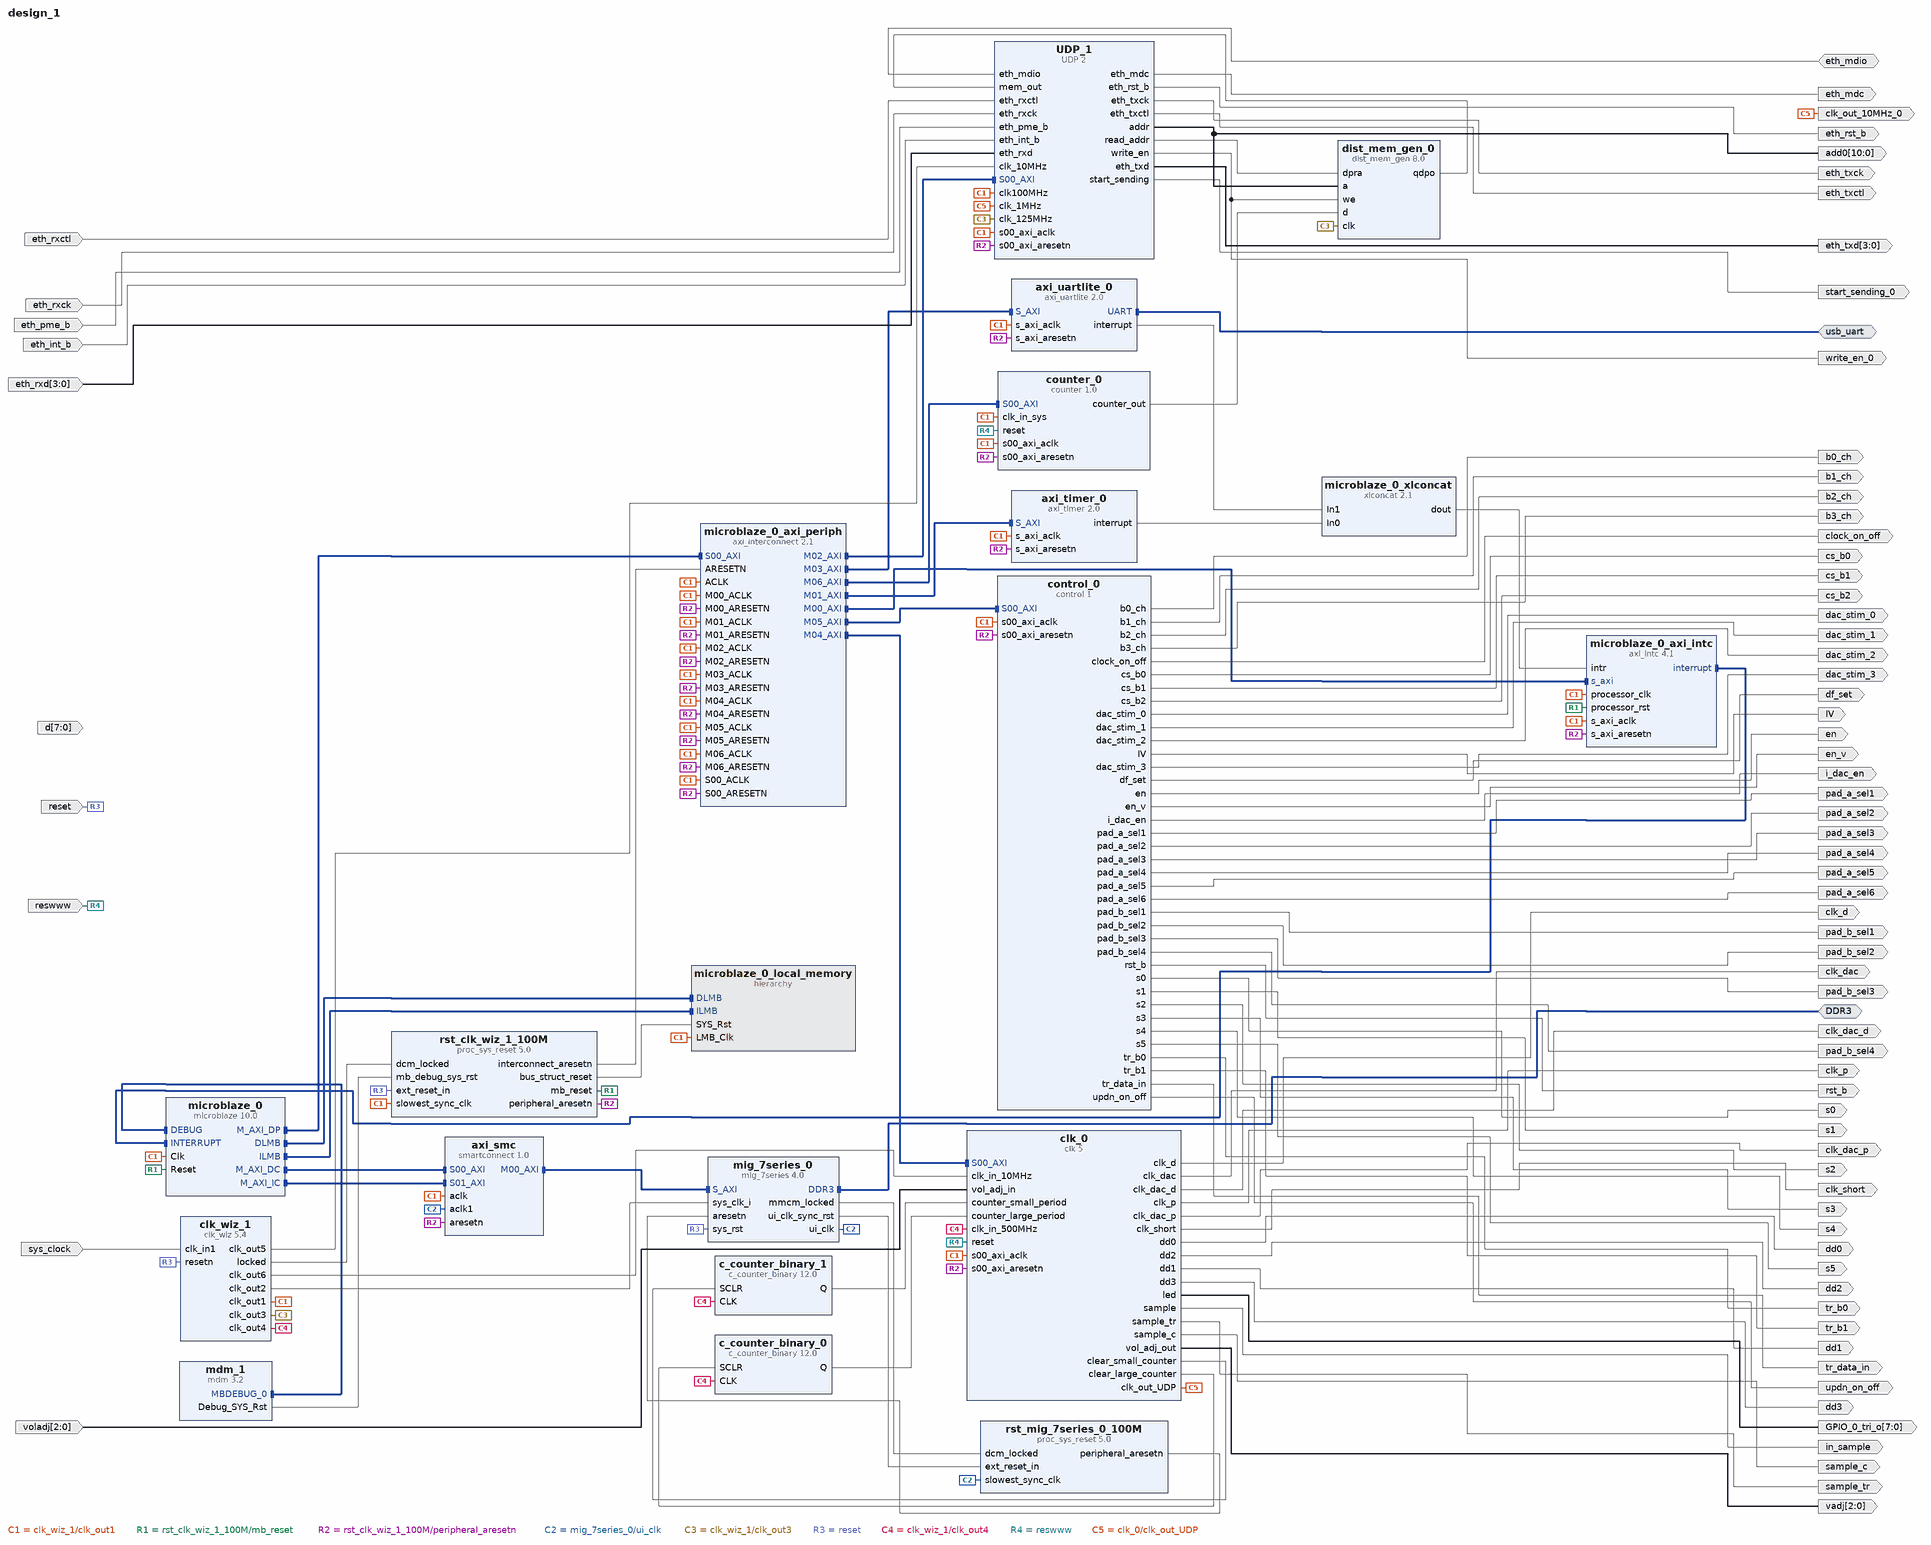
[diagram p0: block diagram of the top level]
# Vivado block design design_1, xc7a200tsbg484-1, Vivado 2017.4
create_bd_design design_1

create_bd_intf_port -mode Master -vlnv xilinx.com:interface:uart_rtl:1.0 usb_uart
create_bd_intf_port -mode Master -vlnv xilinx.com:interface:ddrx_rtl:1.0 DDR3
create_bd_port -dir I -from 7 -to 0 d
create_bd_port -dir I -type rst reset
set_property -dict {CONFIG.POLARITY ACTIVE_LOW} [get_bd_ports reset]
create_bd_port -dir I -type clk sys_clock
set_property -dict {CONFIG.FREQ_HZ 100000000 CONFIG.PHASE 0.000} [get_bd_ports sys_clock]
create_bd_port -dir O eth_rst_b
create_bd_port -dir O eth_mdc
create_bd_port -dir IO eth_mdio
create_bd_port -dir O eth_txck
create_bd_port -dir O eth_txctl
create_bd_port -dir O -from 3 -to 0 eth_txd
create_bd_port -dir I eth_rxctl
create_bd_port -dir I eth_rxck
create_bd_port -dir I eth_pme_b
create_bd_port -dir I eth_int_b
create_bd_port -dir I -from 3 -to 0 eth_rxd
create_bd_port -dir O -from 10 -to 0 add0
create_bd_port -dir O IV
create_bd_port -dir O b0_ch
create_bd_port -dir O b1_ch
create_bd_port -dir O b2_ch
create_bd_port -dir O b3_ch
create_bd_port -dir O -type clk clock_on_off
create_bd_port -dir O cs_b0
create_bd_port -dir O cs_b1
create_bd_port -dir O cs_b2
create_bd_port -dir O dac_stim_0
create_bd_port -dir O dac_stim_1
create_bd_port -dir O dac_stim_2
create_bd_port -dir O dac_stim_3
create_bd_port -dir O df_set
create_bd_port -dir O en
create_bd_port -dir O en_v
create_bd_port -dir O i_dac_en
create_bd_port -dir O pad_a_sel1
create_bd_port -dir O pad_a_sel2
create_bd_port -dir O pad_a_sel3
create_bd_port -dir O pad_a_sel4
create_bd_port -dir O pad_a_sel5
create_bd_port -dir O pad_a_sel6
create_bd_port -dir O pad_b_sel1
create_bd_port -dir O pad_b_sel2
create_bd_port -dir O pad_b_sel3
create_bd_port -dir O pad_b_sel4
create_bd_port -dir O rst_b
create_bd_port -dir O s0
create_bd_port -dir O s1
create_bd_port -dir O s2
create_bd_port -dir O s3
create_bd_port -dir O s4
create_bd_port -dir O s5
create_bd_port -dir O tr_b0
create_bd_port -dir O tr_b1
create_bd_port -dir O tr_data_in
create_bd_port -dir O updn_on_off
create_bd_port -dir O -from 7 -to 0 GPIO_0_tri_o
create_bd_port -dir O -type clk clk_p
create_bd_port -dir O clk_short
create_bd_port -dir O clk_d
create_bd_port -dir O clk_dac
create_bd_port -dir O clk_dac_p
create_bd_port -dir O clk_dac_d
create_bd_port -dir O dd2
create_bd_port -dir O dd3
create_bd_port -dir O dd1
create_bd_port -dir O dd0
create_bd_port -dir I -type rst reswww
set_property -dict {CONFIG.POLARITY ACTIVE_LOW} [get_bd_ports reswww]
create_bd_port -dir I -from 2 -to 0 voladj
create_bd_port -dir O in_sample
create_bd_port -dir O sample_tr
create_bd_port -dir O -from 2 -to 0 vadj
create_bd_port -dir O sample_c
create_bd_port -dir O clk_out_10MHz_0
create_bd_port -dir O write_en_0
create_bd_port -dir O start_sending_0

create_bd_cell -type hier microblaze_0_local_memory
create_bd_cell -type ip -vlnv xilinx.com:ip:xlconcat:2.1 microblaze_0_xlconcat
set_property -dict {CONFIG.NUM_PORTS 2} [get_bd_cells microblaze_0_xlconcat]
create_bd_cell -type ip -vlnv xilinx.com:ip:smartconnect:1.0 axi_smc
set_property -dict {CONFIG.NUM_SI 2 CONFIG.NUM_CLKS 2} [get_bd_cells axi_smc]
create_bd_cell -type ip -vlnv xilinx.com:ip:axi_timer:2.0 axi_timer_0
create_bd_cell -type ip -vlnv xilinx.com:ip:axi_uartlite:2.0 axi_uartlite_0
set_property -dict {CONFIG.USE_BOARD_FLOW true CONFIG.UARTLITE_BOARD_INTERFACE usb_uart} [get_bd_cells axi_uartlite_0]
create_bd_cell -type ip -vlnv xilinx.com:ip:clk_wiz:5.4 clk_wiz_1
set_property -dict [list \
  CONFIG.CLKOUT2_USED true \
  CONFIG.CLKOUT3_USED true \
  CONFIG.CLKOUT4_USED true \
  CONFIG.CLKOUT5_USED true \
  CONFIG.CLKOUT6_USED true \
  CONFIG.NUM_OUT_CLKS 6 \
  CONFIG.CLKOUT2_REQUESTED_OUT_FREQ 200.000 \
  CONFIG.CLKOUT3_REQUESTED_OUT_FREQ 125.000 \
  CONFIG.CLKOUT4_REQUESTED_OUT_FREQ 500.000 \
  CONFIG.CLKOUT5_REQUESTED_OUT_FREQ 20.000 \
  CONFIG.CLKOUT6_REQUESTED_OUT_FREQ 10 \
  CONFIG.PRIM_SOURCE Single_ended_clock_capable_pin \
  CONFIG.RESET_PORT resetn \
  CONFIG.MMCM_DIVCLK_DIVIDE 1 \
  CONFIG.MMCM_CLKOUT1_DIVIDE 5 \
  CONFIG.MMCM_CLKOUT2_DIVIDE 8 \
  CONFIG.MMCM_CLKOUT3_DIVIDE 2 \
  CONFIG.MMCM_CLKOUT4_DIVIDE 50 \
  CONFIG.MMCM_CLKOUT5_DIVIDE 100 \
  CONFIG.RESET_TYPE ACTIVE_LOW \
  CONFIG.USE_BOARD_FLOW true \
  CONFIG.CLK_IN1_BOARD_INTERFACE sys_clock \
  CONFIG.RESET_BOARD_INTERFACE reset \
  CONFIG.CLKOUT2_JITTER 114.829 \
  CONFIG.CLKOUT2_PHASE_ERROR 98.575 \
  CONFIG.CLKOUT3_JITTER 125.247 \
  CONFIG.CLKOUT3_PHASE_ERROR 98.575 \
  CONFIG.CLKOUT4_JITTER 97.082 \
  CONFIG.CLKOUT4_PHASE_ERROR 98.575 \
  CONFIG.CLKOUT5_JITTER 183.243 \
  CONFIG.CLKOUT5_PHASE_ERROR 98.575 \
  CONFIG.CLKOUT6_JITTER 209.588 \
  CONFIG.CLKOUT6_PHASE_ERROR 98.575 \
] [get_bd_cells clk_wiz_1]
create_bd_cell -type ip -vlnv xilinx.com:ip:mdm:3.2 mdm_1
create_bd_cell -type ip -vlnv xilinx.com:ip:microblaze:10.0 microblaze_0
set_property -dict [list \
  CONFIG.C_D_AXI 1 \
  CONFIG.C_D_LMB 1 \
  CONFIG.C_I_LMB 1 \
  CONFIG.C_DEBUG_ENABLED 1 \
  CONFIG.C_USE_ICACHE 1 \
  CONFIG.C_CACHE_BYTE_SIZE 32768 \
  CONFIG.C_USE_DCACHE 1 \
  CONFIG.C_DCACHE_BYTE_SIZE 32768 \
] [get_bd_cells microblaze_0]
create_bd_cell -type ip -vlnv xilinx.com:ip:axi_intc:4.1 microblaze_0_axi_intc
set_property -dict {CONFIG.C_HAS_FAST 1} [get_bd_cells microblaze_0_axi_intc]
create_bd_cell -type ip -vlnv xilinx.com:ip:axi_interconnect:2.1 microblaze_0_axi_periph
set_property -dict {CONFIG.NUM_MI 7 CONFIG.SYNCHRONIZATION_STAGES 2} [get_bd_cells microblaze_0_axi_periph]
create_bd_cell -type ip -vlnv xilinx.com:ip:mig_7series:4.0 mig_7series_0
set_property -dict {CONFIG.XML_INPUT_FILE board.prj CONFIG.RESET_BOARD_INTERFACE reset} [get_bd_cells mig_7series_0]
create_bd_cell -type ip -vlnv xilinx.com:ip:proc_sys_reset:5.0 rst_clk_wiz_1_100M
set_property -dict [list \
  CONFIG.C_EXT_RESET_HIGH 0 \
  CONFIG.USE_BOARD_FLOW true \
  CONFIG.RESET_BOARD_INTERFACE reset \
] [get_bd_cells rst_clk_wiz_1_100M]
create_bd_cell -type ip -vlnv xilinx.com:ip:proc_sys_reset:5.0 rst_mig_7series_0_100M
create_bd_cell -type ip -vlnv xilinx.com:ip:dist_mem_gen:8.0 dist_mem_gen_0
set_property -dict [list \
  CONFIG.depth 2048 \
  CONFIG.data_width 8 \
  CONFIG.memory_type dual_port_ram \
  CONFIG.input_options registered \
  CONFIG.input_clock_enable false \
  CONFIG.qualify_we_with_i_ce false \
  CONFIG.dual_port_address registered \
  CONFIG.simple_dual_port_address non_registered \
  CONFIG.output_options registered \
  CONFIG.Pipeline_Stages 1 \
  CONFIG.common_output_clk true \
  CONFIG.dual_port_output_clock_enable false \
] [get_bd_cells dist_mem_gen_0]
create_bd_cell -type ip -vlnv xilinx.com:user:control:1 control_0
create_bd_cell -type ip -vlnv xilinx.com:ip:c_counter_binary:12.0 c_counter_binary_0
set_property -dict {CONFIG.Implementation DSP48 CONFIG.Output_Width 32 CONFIG.SCLR true} [get_bd_cells c_counter_binary_0]
create_bd_cell -type ip -vlnv xilinx.com:ip:c_counter_binary:12.0 c_counter_binary_1
set_property -dict {CONFIG.Implementation DSP48 CONFIG.Output_Width 32 CONFIG.SCLR true} [get_bd_cells c_counter_binary_1]
create_bd_cell -type ip -vlnv xilinx.com:user:counter:1.0 counter_0
create_bd_cell -type ip -vlnv xilinx.com:user:UDP:2 UDP_1
create_bd_cell -type ip -vlnv xilinx.com:user:clk:5 clk_0

# ---- hierarchy /microblaze_0_local_memory ----
current_bd_instance /microblaze_0_local_memory
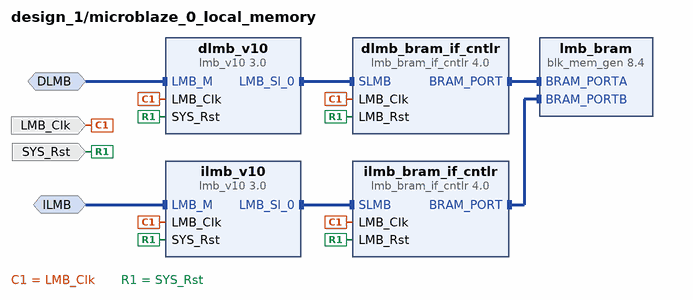
[diagram p1: block diagram inside /microblaze_0_local_memory]
create_bd_intf_pin -mode MirroredMaster -vlnv xilinx.com:interface:lmb_rtl:1.0 DLMB
create_bd_intf_pin -mode MirroredMaster -vlnv xilinx.com:interface:lmb_rtl:1.0 ILMB
create_bd_pin -dir I -type clk LMB_Clk
create_bd_pin -dir I -type rst SYS_Rst

create_bd_cell -type ip -vlnv xilinx.com:ip:lmb_v10:3.0 dlmb_v10
create_bd_cell -type ip -vlnv xilinx.com:ip:lmb_v10:3.0 ilmb_v10
create_bd_cell -type ip -vlnv xilinx.com:ip:lmb_bram_if_cntlr:4.0 dlmb_bram_if_cntlr
set_property -dict {CONFIG.C_ECC 0} [get_bd_cells dlmb_bram_if_cntlr]
create_bd_cell -type ip -vlnv xilinx.com:ip:lmb_bram_if_cntlr:4.0 ilmb_bram_if_cntlr
set_property -dict {CONFIG.C_ECC 0} [get_bd_cells ilmb_bram_if_cntlr]
create_bd_cell -type ip -vlnv xilinx.com:ip:blk_mem_gen:8.4 lmb_bram
set_property -dict [list \
  CONFIG.Memory_Type True_Dual_Port_RAM \
  CONFIG.Enable_B Use_ENB_Pin \
  CONFIG.Use_RSTB_Pin true \
  CONFIG.Port_B_Clock 100 \
  CONFIG.Port_B_Write_Rate 50 \
  CONFIG.Port_B_Enable_Rate 100 \
  CONFIG.use_bram_block BRAM_Controller \
  CONFIG.EN_SAFETY_CKT false \
] [get_bd_cells lmb_bram]

# ---- connections ----

current_bd_instance /microblaze_0_local_memory
connect_bd_intf_net -intf_net microblaze_0_dlmb_bus [get_bd_intf_pins dlmb_v10/LMB_Sl_0] [get_bd_intf_pins dlmb_bram_if_cntlr/SLMB]
connect_bd_intf_net -intf_net microblaze_0_ilmb_bus [get_bd_intf_pins ilmb_v10/LMB_Sl_0] [get_bd_intf_pins ilmb_bram_if_cntlr/SLMB]
connect_bd_intf_net -intf_net microblaze_0_dlmb_cntlr [get_bd_intf_pins dlmb_bram_if_cntlr/BRAM_PORT] [get_bd_intf_pins lmb_bram/BRAM_PORTA]
connect_bd_intf_net -intf_net microblaze_0_ilmb_cntlr [get_bd_intf_pins ilmb_bram_if_cntlr/BRAM_PORT] [get_bd_intf_pins lmb_bram/BRAM_PORTB]
connect_bd_intf_net -intf_net microblaze_0_dlmb [get_bd_intf_pins DLMB] [get_bd_intf_pins dlmb_v10/LMB_M]
connect_bd_intf_net -intf_net microblaze_0_ilmb [get_bd_intf_pins ILMB] [get_bd_intf_pins ilmb_v10/LMB_M]
connect_bd_net -net microblaze_0_Clk [get_bd_pins LMB_Clk] \
  [get_bd_pins dlmb_v10/LMB_Clk] [get_bd_pins ilmb_v10/LMB_Clk] [get_bd_pins dlmb_bram_if_cntlr/LMB_Clk] \
  [get_bd_pins ilmb_bram_if_cntlr/LMB_Clk]
connect_bd_net [get_bd_pins SYS_Rst] \
  [get_bd_pins dlmb_v10/SYS_Rst] [get_bd_pins ilmb_v10/SYS_Rst] [get_bd_pins dlmb_bram_if_cntlr/LMB_Rst] \
  [get_bd_pins ilmb_bram_if_cntlr/LMB_Rst]

current_bd_instance /
connect_bd_intf_net [get_bd_intf_pins microblaze_0/DLMB] [get_bd_intf_pins microblaze_0_local_memory/DLMB]
connect_bd_intf_net [get_bd_intf_pins microblaze_0/ILMB] [get_bd_intf_pins microblaze_0_local_memory/ILMB]
connect_bd_intf_net -intf_net microblaze_0_axi_dp [get_bd_intf_pins microblaze_0_axi_periph/S00_AXI] [get_bd_intf_pins microblaze_0/M_AXI_DP]
connect_bd_intf_net [get_bd_intf_pins microblaze_0_axi_intc/interrupt] [get_bd_intf_pins microblaze_0/INTERRUPT]
connect_bd_intf_net -intf_net microblaze_0_intc_axi [get_bd_intf_pins microblaze_0_axi_periph/M00_AXI] [get_bd_intf_pins microblaze_0_axi_intc/s_axi]
connect_bd_intf_net [get_bd_intf_pins mdm_1/MBDEBUG_0] [get_bd_intf_pins microblaze_0/DEBUG]
connect_bd_intf_net [get_bd_intf_pins microblaze_0_axi_periph/M01_AXI] [get_bd_intf_pins axi_timer_0/S_AXI]
connect_bd_intf_net [get_bd_intf_pins microblaze_0_axi_periph/M03_AXI] [get_bd_intf_pins axi_uartlite_0/S_AXI]
connect_bd_intf_net [get_bd_intf_pins microblaze_0/M_AXI_DC] [get_bd_intf_pins axi_smc/S00_AXI]
connect_bd_intf_net [get_bd_intf_pins axi_smc/M00_AXI] [get_bd_intf_pins mig_7series_0/S_AXI]
connect_bd_intf_net [get_bd_intf_pins microblaze_0/M_AXI_IC] [get_bd_intf_pins axi_smc/S01_AXI]
connect_bd_intf_net [get_bd_intf_pins microblaze_0_axi_periph/M02_AXI] [get_bd_intf_pins UDP_1/S00_AXI]
connect_bd_intf_net [get_bd_intf_pins microblaze_0_axi_periph/M05_AXI] [get_bd_intf_pins control_0/S00_AXI]
connect_bd_intf_net [get_bd_intf_pins microblaze_0_axi_periph/M06_AXI] [get_bd_intf_pins counter_0/S00_AXI]
connect_bd_intf_net [get_bd_intf_pins microblaze_0_axi_periph/M04_AXI] [get_bd_intf_pins clk_0/S00_AXI]
connect_bd_intf_net [get_bd_intf_ports usb_uart] [get_bd_intf_pins axi_uartlite_0/UART]
connect_bd_intf_net [get_bd_intf_ports DDR3] [get_bd_intf_pins mig_7series_0/DDR3]
connect_bd_net -net microblaze_0_intr [get_bd_pins microblaze_0_xlconcat/dout] [get_bd_pins microblaze_0_axi_intc/intr]
connect_bd_net -net microblaze_0_Clk [get_bd_pins clk_wiz_1/clk_out1] \
  [get_bd_pins axi_smc/aclk] [get_bd_pins axi_timer_0/s_axi_aclk] [get_bd_pins axi_uartlite_0/s_axi_aclk] \
  [get_bd_pins microblaze_0/Clk] [get_bd_pins microblaze_0_axi_intc/s_axi_aclk] \
  [get_bd_pins microblaze_0_axi_intc/processor_clk] [get_bd_pins rst_clk_wiz_1_100M/slowest_sync_clk] \
  [get_bd_pins control_0/s00_axi_aclk] [get_bd_pins counter_0/clk_in_sys] [get_bd_pins counter_0/s00_axi_aclk] \
  [get_bd_pins UDP_1/clk100MHz] [get_bd_pins UDP_1/s00_axi_aclk] [get_bd_pins microblaze_0_local_memory/LMB_Clk] \
  [get_bd_pins microblaze_0_axi_periph/ACLK] [get_bd_pins microblaze_0_axi_periph/S00_ACLK] \
  [get_bd_pins microblaze_0_axi_periph/M00_ACLK] [get_bd_pins microblaze_0_axi_periph/M01_ACLK] \
  [get_bd_pins microblaze_0_axi_periph/M02_ACLK] [get_bd_pins microblaze_0_axi_periph/M03_ACLK] \
  [get_bd_pins microblaze_0_axi_periph/M04_ACLK] [get_bd_pins microblaze_0_axi_periph/M05_ACLK] \
  [get_bd_pins microblaze_0_axi_periph/M06_ACLK] [get_bd_pins clk_0/s00_axi_aclk]
connect_bd_net [get_bd_pins clk_wiz_1/locked] [get_bd_pins rst_clk_wiz_1_100M/dcm_locked]
connect_bd_net [get_bd_pins rst_clk_wiz_1_100M/mb_reset] [get_bd_pins microblaze_0/Reset] [get_bd_pins microblaze_0_axi_intc/processor_rst]
connect_bd_net [get_bd_pins rst_clk_wiz_1_100M/bus_struct_reset] [get_bd_pins microblaze_0_local_memory/SYS_Rst]
connect_bd_net [get_bd_pins rst_clk_wiz_1_100M/interconnect_aresetn] [get_bd_pins microblaze_0_axi_periph/ARESETN]
connect_bd_net [get_bd_pins rst_clk_wiz_1_100M/peripheral_aresetn] \
  [get_bd_pins axi_smc/aresetn] [get_bd_pins axi_timer_0/s_axi_aresetn] [get_bd_pins axi_uartlite_0/s_axi_aresetn] \
  [get_bd_pins microblaze_0_axi_intc/s_axi_aresetn] [get_bd_pins control_0/s00_axi_aresetn] \
  [get_bd_pins counter_0/s00_axi_aresetn] [get_bd_pins UDP_1/s00_axi_aresetn] \
  [get_bd_pins microblaze_0_axi_periph/S00_ARESETN] [get_bd_pins microblaze_0_axi_periph/M00_ARESETN] \
  [get_bd_pins microblaze_0_axi_periph/M01_ARESETN] [get_bd_pins microblaze_0_axi_periph/M02_ARESETN] \
  [get_bd_pins microblaze_0_axi_periph/M03_ARESETN] [get_bd_pins microblaze_0_axi_periph/M04_ARESETN] \
  [get_bd_pins microblaze_0_axi_periph/M05_ARESETN] [get_bd_pins microblaze_0_axi_periph/M06_ARESETN] \
  [get_bd_pins clk_0/s00_axi_aresetn]
connect_bd_net [get_bd_pins mdm_1/Debug_SYS_Rst] [get_bd_pins rst_clk_wiz_1_100M/mb_debug_sys_rst]
connect_bd_net [get_bd_pins clk_wiz_1/clk_out2] [get_bd_pins mig_7series_0/sys_clk_i]
connect_bd_net [get_bd_pins mig_7series_0/ui_clk] [get_bd_pins axi_smc/aclk1] [get_bd_pins rst_mig_7series_0_100M/slowest_sync_clk]
connect_bd_net [get_bd_pins mig_7series_0/mmcm_locked] [get_bd_pins rst_mig_7series_0_100M/dcm_locked]
connect_bd_net [get_bd_pins mig_7series_0/ui_clk_sync_rst] [get_bd_pins rst_mig_7series_0_100M/ext_reset_in]
connect_bd_net [get_bd_pins rst_mig_7series_0_100M/peripheral_aresetn] [get_bd_pins mig_7series_0/aresetn]
connect_bd_net [get_bd_pins axi_timer_0/interrupt] [get_bd_pins microblaze_0_xlconcat/In0]
connect_bd_net [get_bd_pins clk_wiz_1/clk_out3] [get_bd_pins dist_mem_gen_0/clk] [get_bd_pins UDP_1/clk_125MHz]
connect_bd_net [get_bd_ports reset] [get_bd_pins clk_wiz_1/resetn] [get_bd_pins mig_7series_0/sys_rst] [get_bd_pins rst_clk_wiz_1_100M/ext_reset_in]
connect_bd_net [get_bd_ports sys_clock] [get_bd_pins clk_wiz_1/clk_in1]
connect_bd_net [get_bd_pins UDP_1/eth_rst_b] [get_bd_ports eth_rst_b]
connect_bd_net [get_bd_pins UDP_1/eth_mdc] [get_bd_ports eth_mdc]
connect_bd_net [get_bd_ports eth_mdio] [get_bd_pins UDP_1/eth_mdio]
connect_bd_net [get_bd_pins UDP_1/eth_txck] [get_bd_ports eth_txck]
connect_bd_net [get_bd_pins UDP_1/eth_txctl] [get_bd_ports eth_txctl]
connect_bd_net [get_bd_pins UDP_1/eth_txd] [get_bd_ports eth_txd]
connect_bd_net [get_bd_pins UDP_1/read_addr] [get_bd_pins dist_mem_gen_0/dpra]
connect_bd_net [get_bd_ports eth_rxctl] [get_bd_pins UDP_1/eth_rxctl]
connect_bd_net [get_bd_ports eth_rxck] [get_bd_pins UDP_1/eth_rxck]
connect_bd_net [get_bd_ports eth_pme_b] [get_bd_pins UDP_1/eth_pme_b]
connect_bd_net [get_bd_ports eth_int_b] [get_bd_pins UDP_1/eth_int_b]
connect_bd_net [get_bd_ports eth_rxd] [get_bd_pins UDP_1/eth_rxd]
connect_bd_net [get_bd_pins UDP_1/addr] [get_bd_ports add0] [get_bd_pins dist_mem_gen_0/a]
connect_bd_net [get_bd_pins control_0/IV] [get_bd_ports IV]
connect_bd_net [get_bd_pins control_0/b0_ch] [get_bd_ports b0_ch]
connect_bd_net [get_bd_pins control_0/b1_ch] [get_bd_ports b1_ch]
connect_bd_net [get_bd_pins control_0/b2_ch] [get_bd_ports b2_ch]
connect_bd_net [get_bd_pins control_0/b3_ch] [get_bd_ports b3_ch]
connect_bd_net [get_bd_pins control_0/clock_on_off] [get_bd_ports clock_on_off]
connect_bd_net [get_bd_pins control_0/cs_b0] [get_bd_ports cs_b0]
connect_bd_net [get_bd_pins control_0/cs_b1] [get_bd_ports cs_b1]
connect_bd_net [get_bd_pins control_0/cs_b2] [get_bd_ports cs_b2]
connect_bd_net [get_bd_pins control_0/dac_stim_0] [get_bd_ports dac_stim_0]
connect_bd_net [get_bd_pins control_0/dac_stim_1] [get_bd_ports dac_stim_1]
connect_bd_net [get_bd_pins control_0/dac_stim_2] [get_bd_ports dac_stim_2]
connect_bd_net [get_bd_pins control_0/dac_stim_3] [get_bd_ports dac_stim_3]
connect_bd_net [get_bd_pins control_0/df_set] [get_bd_ports df_set]
connect_bd_net [get_bd_pins control_0/en] [get_bd_ports en]
connect_bd_net [get_bd_pins control_0/en_v] [get_bd_ports en_v]
connect_bd_net [get_bd_pins control_0/i_dac_en] [get_bd_ports i_dac_en]
connect_bd_net [get_bd_pins control_0/pad_a_sel1] [get_bd_ports pad_a_sel1]
connect_bd_net [get_bd_pins control_0/pad_a_sel2] [get_bd_ports pad_a_sel2]
connect_bd_net [get_bd_pins control_0/pad_a_sel3] [get_bd_ports pad_a_sel3]
connect_bd_net [get_bd_pins control_0/pad_a_sel4] [get_bd_ports pad_a_sel4]
connect_bd_net [get_bd_pins control_0/pad_a_sel5] [get_bd_ports pad_a_sel5]
connect_bd_net [get_bd_pins control_0/pad_a_sel6] [get_bd_ports pad_a_sel6]
connect_bd_net [get_bd_pins control_0/pad_b_sel1] [get_bd_ports pad_b_sel1]
connect_bd_net [get_bd_pins control_0/pad_b_sel2] [get_bd_ports pad_b_sel2]
connect_bd_net [get_bd_pins control_0/pad_b_sel3] [get_bd_ports pad_b_sel3]
connect_bd_net [get_bd_pins control_0/pad_b_sel4] [get_bd_ports pad_b_sel4]
connect_bd_net [get_bd_pins control_0/rst_b] [get_bd_ports rst_b]
connect_bd_net [get_bd_pins control_0/s0] [get_bd_ports s0]
connect_bd_net [get_bd_pins control_0/s1] [get_bd_ports s1]
connect_bd_net [get_bd_pins control_0/s2] [get_bd_ports s2]
connect_bd_net [get_bd_pins control_0/s3] [get_bd_ports s3]
connect_bd_net [get_bd_pins control_0/s4] [get_bd_ports s4]
connect_bd_net [get_bd_pins control_0/s5] [get_bd_ports s5]
connect_bd_net [get_bd_pins control_0/tr_b0] [get_bd_ports tr_b0]
connect_bd_net [get_bd_pins control_0/tr_b1] [get_bd_ports tr_b1]
connect_bd_net [get_bd_pins control_0/tr_data_in] [get_bd_ports tr_data_in]
connect_bd_net [get_bd_pins control_0/updn_on_off] [get_bd_ports updn_on_off]
connect_bd_net [get_bd_pins axi_uartlite_0/interrupt] [get_bd_pins microblaze_0_xlconcat/In1]
connect_bd_net [get_bd_pins clk_wiz_1/clk_out4] \
  [get_bd_pins c_counter_binary_0/CLK] [get_bd_pins c_counter_binary_1/CLK] [get_bd_pins clk_0/clk_in_500MHz]
connect_bd_net [get_bd_ports reswww] [get_bd_pins counter_0/reset] [get_bd_pins clk_0/reset]
connect_bd_net [get_bd_pins counter_0/counter_out] [get_bd_pins dist_mem_gen_0/d]
connect_bd_net [get_bd_pins dist_mem_gen_0/qdpo] [get_bd_pins UDP_1/mem_out]
connect_bd_net [get_bd_pins clk_wiz_1/clk_out5] [get_bd_pins UDP_1/clk_10MHz]
connect_bd_net -net clock_gen_0_clk_out_10MHz [get_bd_pins clk_0/clk_out_UDP] [get_bd_ports clk_out_10MHz_0] [get_bd_pins UDP_1/clk_1MHz]
connect_bd_net [get_bd_pins UDP_1/write_en] [get_bd_ports write_en_0] [get_bd_pins dist_mem_gen_0/we]
connect_bd_net [get_bd_pins UDP_1/start_sending] [get_bd_ports start_sending_0]
connect_bd_net [get_bd_pins c_counter_binary_1/Q] [get_bd_pins clk_0/counter_small_period]
connect_bd_net [get_bd_pins c_counter_binary_0/Q] [get_bd_pins clk_0/counter_large_period]
connect_bd_net [get_bd_pins clk_0/clear_small_counter] [get_bd_pins c_counter_binary_1/SCLR]
connect_bd_net [get_bd_pins clk_0/clear_large_counter] [get_bd_pins c_counter_binary_0/SCLR]
connect_bd_net [get_bd_pins clk_0/led] [get_bd_ports GPIO_0_tri_o]
connect_bd_net [get_bd_pins clk_0/clk_p] [get_bd_ports clk_p]
connect_bd_net [get_bd_pins clk_0/clk_short] [get_bd_ports clk_short]
connect_bd_net [get_bd_pins clk_0/clk_d] [get_bd_ports clk_d]
connect_bd_net [get_bd_pins clk_0/clk_dac] [get_bd_ports clk_dac]
connect_bd_net [get_bd_pins clk_0/clk_dac_p] [get_bd_ports clk_dac_p]
connect_bd_net [get_bd_pins clk_0/clk_dac_d] [get_bd_ports clk_dac_d]
connect_bd_net [get_bd_pins clk_0/dd2] [get_bd_ports dd2]
connect_bd_net [get_bd_pins clk_0/dd3] [get_bd_ports dd3]
connect_bd_net [get_bd_pins clk_0/dd1] [get_bd_ports dd1]
connect_bd_net [get_bd_pins clk_0/dd0] [get_bd_ports dd0]
connect_bd_net [get_bd_pins clk_0/sample] [get_bd_ports in_sample]
connect_bd_net [get_bd_pins clk_0/sample_tr] [get_bd_ports sample_tr]
connect_bd_net [get_bd_pins clk_0/sample_c] [get_bd_ports sample_c]
connect_bd_net [get_bd_pins clk_0/vol_adj_out] [get_bd_ports vadj]
connect_bd_net [get_bd_pins clk_wiz_1/clk_out6] [get_bd_pins clk_0/clk_in_10MHz]
connect_bd_net [get_bd_ports voladj] [get_bd_pins clk_0/vol_adj_in]

# ---- address map ----
assign_bd_address -offset 0x00000000 -range 128K -target_address_space [get_bd_addr_spaces microblaze_0/Data] [get_bd_addr_segs microblaze_0_local_memory/dlmb_bram_if_cntlr/SLMB/Mem]
assign_bd_address -offset 0x40600000 -range 64K -target_address_space [get_bd_addr_spaces microblaze_0/Data] [get_bd_addr_segs axi_uartlite_0/S_AXI/Reg]
assign_bd_address -offset 0x41200000 -range 64K -target_address_space [get_bd_addr_spaces microblaze_0/Data] [get_bd_addr_segs microblaze_0_axi_intc/S_AXI/Reg]
assign_bd_address -offset 0x41C00000 -range 64K -target_address_space [get_bd_addr_spaces microblaze_0/Data] [get_bd_addr_segs axi_timer_0/S_AXI/Reg]
assign_bd_address -offset 0x44A00000 -range 64K -target_address_space [get_bd_addr_spaces microblaze_0/Data] [get_bd_addr_segs UDP_1/S00_AXI/S00_AXI_reg]
assign_bd_address -offset 0x44A10000 -range 64K -target_address_space [get_bd_addr_spaces microblaze_0/Data] [get_bd_addr_segs clk_0/S00_AXI/S00_AXI_reg]
assign_bd_address -offset 0x44A20000 -range 64K -target_address_space [get_bd_addr_spaces microblaze_0/Data] [get_bd_addr_segs control_0/S00_AXI/S00_AXI_reg]
assign_bd_address -offset 0x44A30000 -range 64K -target_address_space [get_bd_addr_spaces microblaze_0/Data] [get_bd_addr_segs counter_0/S00_AXI/S00_AXI_reg]
assign_bd_address -offset 0x80000000 -range 512M -target_address_space [get_bd_addr_spaces microblaze_0/Data] [get_bd_addr_segs mig_7series_0/memmap/memaddr]
assign_bd_address -offset 0x00000000 -range 128K -target_address_space [get_bd_addr_spaces microblaze_0/Instruction] [get_bd_addr_segs microblaze_0_local_memory/ilmb_bram_if_cntlr/SLMB/Mem]
assign_bd_address -offset 0x80000000 -range 512M -target_address_space [get_bd_addr_spaces microblaze_0/Instruction] [get_bd_addr_segs mig_7series_0/memmap/memaddr]

validate_bd_design
save_bd_design
